# Altium schematic sheet Power.SchDoc
size A4; SheetNumber: 8; SheetTotal: 8
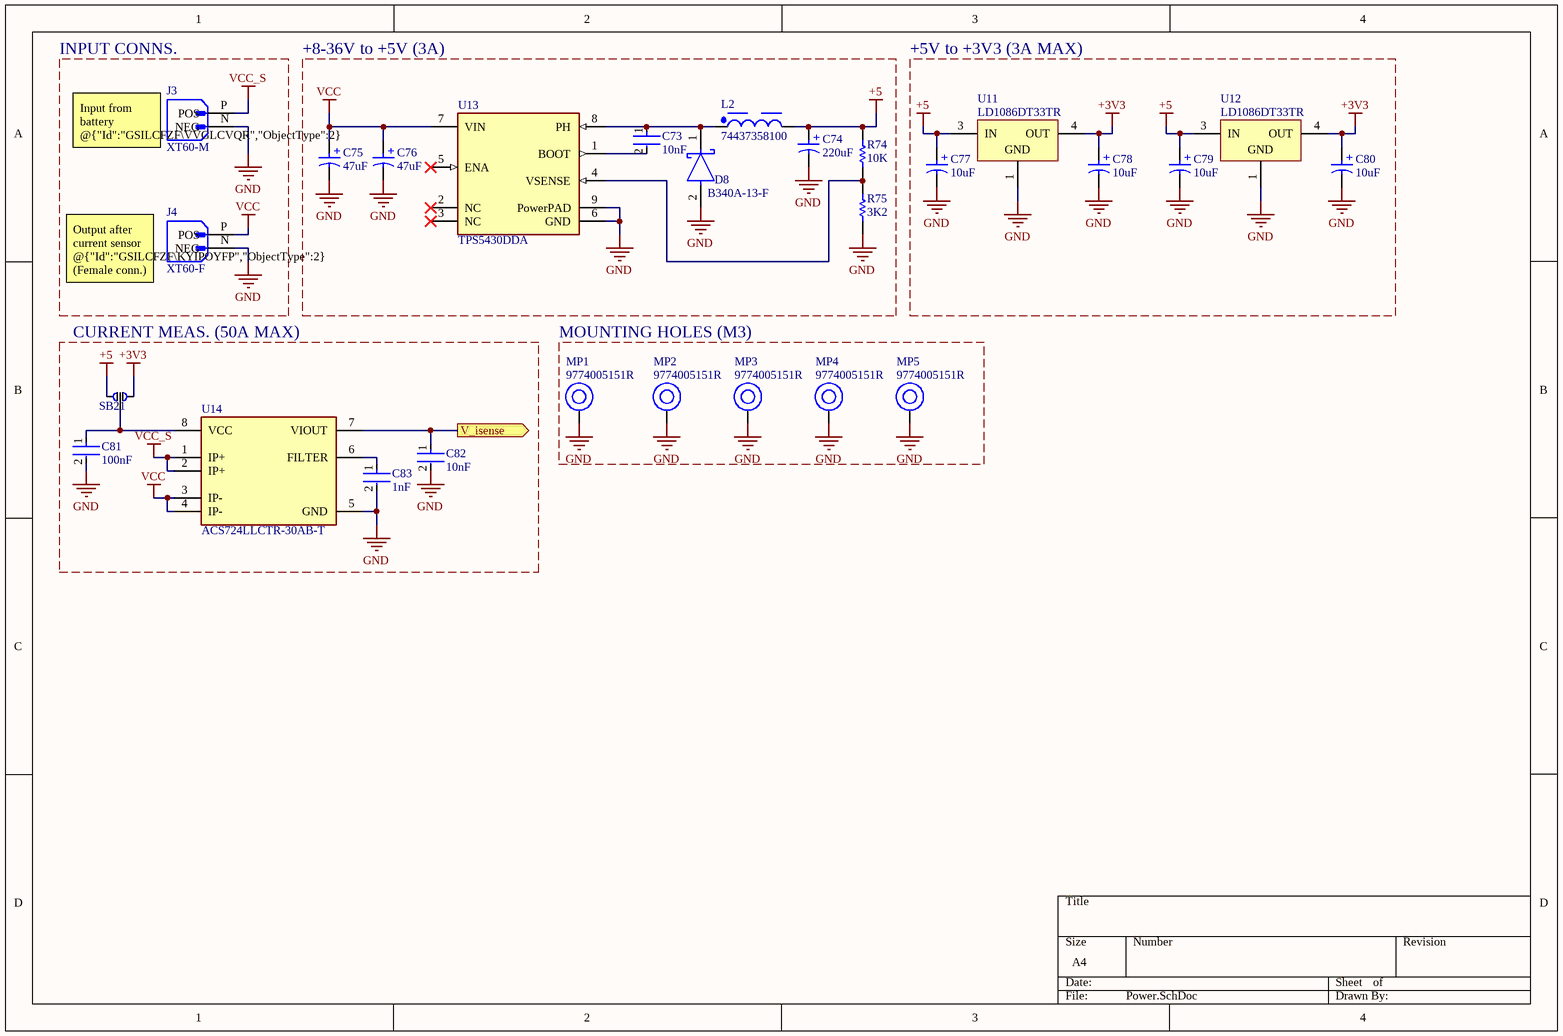
[diagram p0: Power.SchDoc]

## Parts
C73  10nF  [FP-GRM188-0_1-e0_2_0_55-IPC_A]
C74  220uF  [WCAP-ASLI_D8H10.5]
C75  47uF  [WCAP-PSLP_D6.3H7.7]
C76  47uF  [WCAP-PSLP_D6.3H7.7]
C77  10uF  [WCAP-ASLL_D6.3H5.5]
C78  10uF  [WCAP-ASLL_D6.3H5.5]
C79  10uF  [WCAP-ASLL_D6.3H5.5]
C80  10uF  [WCAP-ASLL_D6.3H5.5]
C81  100nF  [FP-GRM188-0_1-e0_2_0_55-IPC_A]
C82  10nF  [FP-GRM188-0_1-e0_2_0_55-IPC_A]
C83  1nF  [FP-GRM188-0_1-e0_2_0_55-IPC_A]
D8  B340A-13-F  [FP-SMA-MFG]
J3  XT60-M  [AMASS_XT60-M]
J4  XT60-F  [AMASS_XT60-M]
L2  74437358100  [WE-LHMI_8040]
MP1  9774005151R  [9774005151]
MP2  9774005151R  [9774005151]
MP3  9774005151R  [9774005151]
MP4  9774005151R  [9774005151]
MP5  9774005151R  [9774005151]
R74  10K  [RESC1608X90X30ML15T20]
R75  3K2  [RESC1608X90X30ML15T20]
SB21  Solderbridge3P  [SolderBridge3P]  (value not drawn)
U11  LD1086DT33TR  [TO-252_L]
U12  LD1086DT33TR  [TO-252_L]
U13  TPS5430DDA  [FP-DDA0008J-MFG]
U14  ACS724LLCTR-30AB-T  [FP-LCN-8-IPC_A]

## Blocks framed on the sheet
INPUT CONNS.: J3 J4
+8-36V to +5V (3A): C73-C76 D8 L2 R74 R75 U13
+5V to +3V3 (3A MAX): C77-C80 U11 U12
CURRENT MEAS. (50A MAX): C81-C83 SB21 U14
MOUNTING HOLES (M3): MP1-MP5

## Ports
V_isense (out, see NAVC_MCU[1A])

## Nets
+3V3: C78.1(P) C80.1(P) SB21.2 U11.4(OUT) U12.4(OUT)
+5: C74.1(P) C77.1(P) C79.1(P) L2.2 R74.2 SB21.1 U11.3(IN) U12.3(IN)
GND: C74.2(N) C75.2(N) C76.2(N) C77.2(N) C78.2(N) C79.2(N) C80.2(N) C81.2 C82.2 C83.2 D8.2(A) J3.N(NEG) J4.N(NEG) MP1.1 MP2.1 MP3.1 MP4.1 MP5.1 R75.1 U11.1(GND) U12.1(GND) U13.6(GND) U13.9(PowerPAD) U14.5(GND)
VCC: C75.1(P) C76.1(P) J4.P(POS) U13.7(VIN) U14.3(IP-) U14.4(IP-)
VCC_S: J3.P(POS) U14.1(IP+) U14.2(IP+)
V_isense: C82.1 U14.7(VIOUT) ; port V_isense
NetC73_1: C73.1 D8.1(C) L2.1 U13.8(PH)
NetC73_2: C73.2 U13.1(BOOT)
NetC81_1: C81.1 SB21.3 U14.8(VCC)
NetC83_1: C83.1 U14.6(FILTER)
NetR74_1: R74.1 R75.2 U13.4(VSENSE)

Not connected (* = marked no-connect by the designer): U13 2(NC)* 3(NC)* 5(ENA)*

## Notes on the sheet
- (near J3) Input from battery @{"Id":"GSILCFZF\VVGLCVQR","ObjectType":2}
  (Male conn.)
- Output after current sensor @{"Id":"GSILCFZF\KYIPOYFP","ObjectType":2}
  (Female conn.)
- (in symbol CMP-03913-53914528-2) +
- (in symbol CMP-03913-54202498-1) +
- (in symbol CMP-03913-89977562-1) +

## Library data of the parts
C73 C81-C83 = CMP-2006-02792-2: Chip Multilayer Ceramic Capacitors for General Purpose, 0603, 10uF, X5R, 15%, 20%, 6.3V; Packaging: Tape and Reel; Voltage Rating (DC): 6.3V; Width: 0.031inch; Termination: SMD/SMT; Dielectric: X5R; Package Quantity: 4000; Voltage Rating: 6.3V; Capacitance: 10uF; Case/Package: 0603; Min Operating Temperature: -55°C; Voltage: 6.3V; Length: 1.6mm; Thickness: 0.035inch; Lead Free: Lead Free; Depth: 0.8mm; Case Code (Imperial): 0603; Max Operating Temperature: 85°C; Material: Ceramic; Height: 0.8mm; Tolerance: 20%; Mount: Surface Mount; REACH SVHC: No SVHC; Radiation Hardening: No; Case Code (Metric): 1608
C74 = CMP-03913-54202498-1: 865080553014 Alum. Electrolytic Cap 220µF 35V 8mmV-Chip WCAP-ASLI; Lifetime 2000h +105°C; Life (Hours): 2000hours; Impedance: 210mΩ; Ripple Current: 570mA; Tolerance: 20%; Polarity: Polar; ESR (Equivalent Series Resistance): 131.909mΩ; Insulation Resistance: 454.545kΩ; Leakage Current: 77µA; Height - Seated (Max): 10.4902mm; Capacitance: 220µF; Mount: Surface Mount; Voltage Rating (DC): 35V; Case/Package: Radial; Width: 8.3mm; NexarPartId: 54202498; Ripple Current (AC): 570mA; REACH SVHC: Unknown; Min Operating Temperature: -55°C; Diameter: 8mm; Max Operating Temperature: 105°C; RoHS: Compliant; Packaging: Tape & Reel (TR); Height: 10.5mm; Length: 10.5mm; Voltage Rating: 35V
C75 C76 = CMP-03913-89977562-1: 875105645005 Cap, 47Uf, 35V, Alu Elec Smd, Polymer Rohs Compliant: Yes; Ripple Current: 1.6A; Leakage Current: 600µA; ESR (Equivalent Series Resistance): 50mΩ; Capacitance: 47µF; Length: 7.7mm; Diameter: 6.3mm; NexarPartId: 89977562; Voltage Rating: 35V; Width: 6.6mm
C77-C80 = CMP-03913-53914528-2: 865060643005 WCAP-ASLL Aluminum Electrolytic Capacitors; Polarity: Polar; Insulation Resistance: 10MΩ; Ripple Current (AC): 165mA; Tolerance: 20%; Leakage Current: 5µA; ESR (Equivalent Series Resistance): 1.13596Ω; Capacitance: 10µF; Life (Hours): 2000hours; Impedance: 1.4Ω; Voltage Rating: 50V; Max Operating Temperature: 105°C; Diameter: 6.3mm; Case/Package: Radial; Length: 5.5mm; NexarPartId: 53914528; REACH SVHC: Unknown; Min Operating Temperature: -55°C; RoHS: Compliant; Ripple Current: 165mA; Mount: Surface Mount; Height - Seated (Max): 5.5118mm; Height: 5.5mm; Voltage Rating (DC): 50V
D8 = CMP-1667-00003-3: DIODE SCHOTTKY 40V 3A SMA; Max Forward Surge Current (Ifsm): 80A; Forward Voltage: 500mV; Polarity: Standard; Max Reverse Current: 500uA; Capacitance: 250pF; Element Configuration: Single; Mount: Surface Mount; Output Current: 3A; Radiation Hardening: No; Width: 2.92mm; Current Rating: 3A; Termination: SMD/SMT; Voltage: 40V; Series: -; Max Operating Temperature: 125°C; Current: 3A; Max Repetitive Reverse Voltage (Vrrm): 40V; Min Operating Temperature: -55°C; REACH SVHC: No SVHC; Number of Pins: 2; Average Rectified Current: 3A; Contact Plating: Tin; RoHS Compliant: Yes; Max Reverse Voltage (DC): 40V; Packaging: Tape and Reel; Height: 2.3mm; Length: 4.6mm; Case/Package: SMA; Weight: 0.002258oz; Peak Non-Repetitive Surge Current: 80A; Package Quantity: 5000; Lead Free: Lead Free; Forward Current: 3A; Voltage Rating (DC): 40V
J3 J4 = XT60-M: Plug; DC supply; XT60; male; PIN: 2; for cable; soldered; 30A; 500V; MF: AMASS; SnapEDA_Link: https://www.snapeda.com/parts/XT60-M/AMASS/view-part/?ref=snap; Package: Package; Value: *; MP: XT60-M; Check_prices: https://www.snapeda.com/parts/XT60-M/AMASS/view-part/?ref=eda
  J3: Component Type: Source
L2 = CMP-03913-61645318-4: 74437358100 Power Inductor, 10Uh, Shielded, 4.5A Rohs Compliant: Yes; Test Frequency: 100kHz; Core Material: Ferrite; DC Resistance (DCR): 48.1mΩ; Tolerance: 20%; Self Resonant Frequency: 9MHz; Saturation Current: 8.3A; Inductance: 10µH; Ambient Temperature Range High: 85°C; Width: 8.5mm; Min Operating Temperature: -40°C; Height: 4mm; Packaging: Tape & Reel (TR); Ambient Temperature Range Low: -40°C; Mount: Surface Mount; Shielding: Shielded; Max Operating Temperature: 125°C; Height - Seated (Max): 3.9878mm; NexarPartId: 61645318; Current Rating: 4.5A; Case/Package: Nonstandard; RoHS: Compliant; Composition: Wirewound; Length: 9.7mm
MP1-MP5 = CMP-03913-118042550-1: 9774005151R WA-SMSI SMT Steel Spacer, M2.5 Internal non Stop; Material: Steel; Max Operating Temperature: 150°C; RoHS: Compliant; Packaging: Tape and Reel; Min Operating Temperature: -55°C; Length: 500µm; NexarPartId: 118042550
R74 R75 = CMP-2000-00869-1: Part Number: ERT-J1VR103J; Manufacturer: Panasonic
U11 U12 = CMP-0244-00125-1: 1.5A, Low Drop Positive Voltage Regulator, 3.3V, 3-Pin DPAK, Tape and Reel; ComponentLink2URL: http://www.st.com/internet/com/TECHNICAL_RESOURCES/TECHNICAL_LITERATURE/DATASHEET/CD00001884.pdf; ComponentLink1URL: http://www.st.com; PackageReference: TO-252; ComponentLink1Description: Manufacturer URL; ComponentLink2Description: Datasheet; PackageVersion: 2011; PackageDescription: 3-Pin Transistor Outline Package 2.28 mm Pitch, 9.7 mm Lead Span (DPAK); DatasheetVersion: 11/07/2011; Component Type: VRM
U13 = CMP-2000-04960-2: IC REG BUCK ADJUSTABLE 3A 8SOPWR; Manufacturer: Texas Instruments; Max Junction Temp: +125°C; Max Supply Voltage: 36V; Switching Frequency: 500kHz; Output Type: AdjustableProgrammable; Standoff Height: 0mm; Output Voltage: 1.23-31V; Max Duty Cycle: 89%; Nominal Supply Current: 3mA; Min Supply Voltage: 5.5V; Number Of Outputs: 1; Temperature: -40°C to +125°C; Temperature Range High: +125°C; Manufacturer Part Number: TPS5430DDA; Device Class L3: Voltage Regulators - Switching; Mouser Description: Voltage Regulators - Switching Regulators 5.5 to 36V Input 3A Step Dwn Converter; Switching Topology: Buck; ComponentLink2URL: http://www.ti.com/lit/ds/symlink/tps5431.pdf; ComponentLink2Description: Datasheet; Device Class L2: Power Management ICs; Device Class L1: Integrated Circuits (ICs); Digikey Description: IC REG BUCK ADJUSTABLE 3A 8SOPWR; RoHS: TRUE; Octopart: https://octopart.com/tps5430dda-texas+instruments-589977; Output Current: 3A; Automotive: No; Lead Free: Yes; Category: IC; Package: DDA0008J; Temperature Range Low: -40°C; Height: 1.7mm; Component Type: VRM
U14 = CMP-82923-000166-2: SENSOR CURRENT HALL 30A AC/DC; Number of Channels: 1; Response Time: 4us; Polarity: Bidirectional; Frequency: 120kHz; Max Supply Current: 14mA; Accuracy: 0.8%; Linearity: 1.5%; Sensitivity: 66mV/A; Min Operating Temperature: -40°C; Case/Package: SOIC; Current Sensing: 30A; Packaging: Tape and Reel; Number of Pins: 8; Mount: Surface Mount; Max Operating Temperature: 150°C; RoHS Compliant: Yes